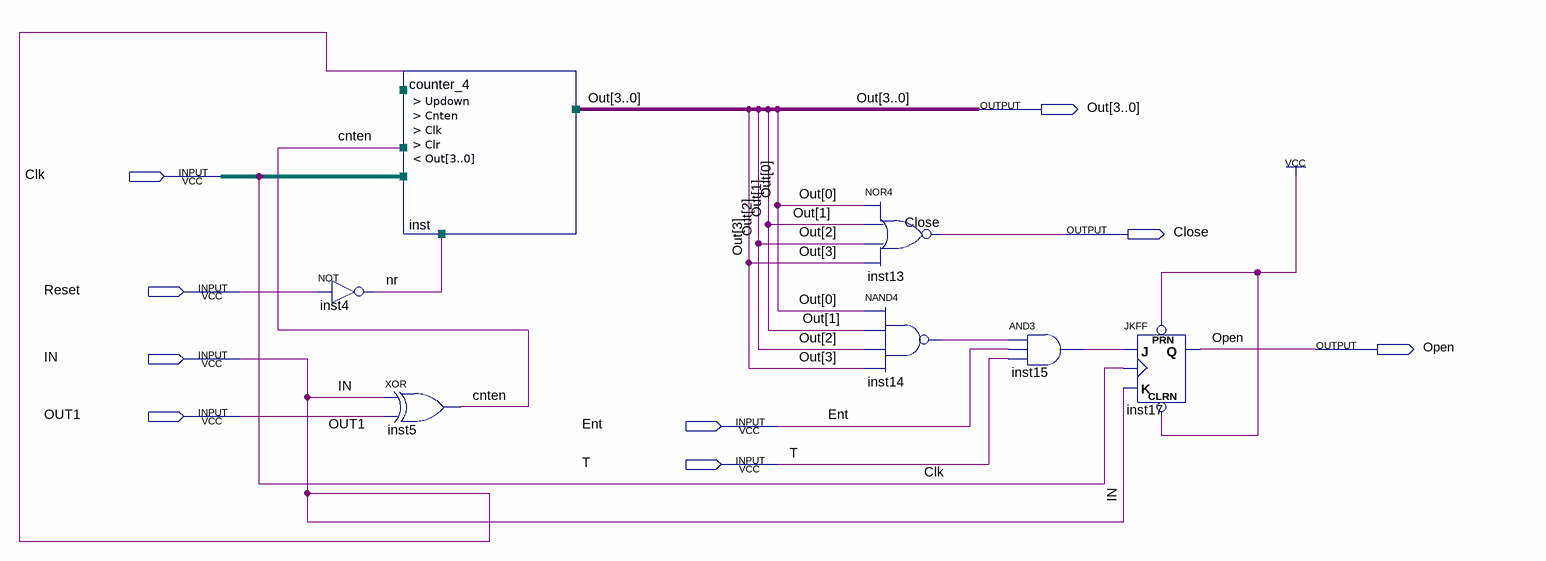
[diagram p0: schematic sheet]
// Quartus schematic main.bdf as structural Verilog: 7 symbols, 9 pins
module main (
  input  Clk,
  input  Reset,
  input  IN,
  input  OUT1,
  input  Ent,
  input  T,
  output [3:0] Out,
  output Close,
  output Open
);

  wire cnten, inst14_out, inst15_out, nr;

  not inst4 (nr, Reset);
  xor inst5 (cnten, IN, OUT1);
  counter_4 inst (.Updown(IN), .Cnten(cnten), .Clk(Clk), .Clr(nr), .Out({Out[3:2], OUT1, Out[0]}));
  nor inst13 (Close, Out[0], OUT1, Out[2], Out[3]);
  nand inst14 (inst14_out, Out[0], OUT1, Out[2], Out[3]);
  and inst15 (inst15_out, inst14_out, Ent, T);
  JKFF inst17 (.PRN(1'b1), .CLRN(1'b1), .K(IN), .J(inst15_out), .CLK(Clk), .Q(Open));

  assign Out[1] = OUT1;
endmodule
